# Altium schematic sheet SD_CARD_WiFi.SchDoc: =DocumentName
size B; SheetNumber: 3; SheetTotal: 8
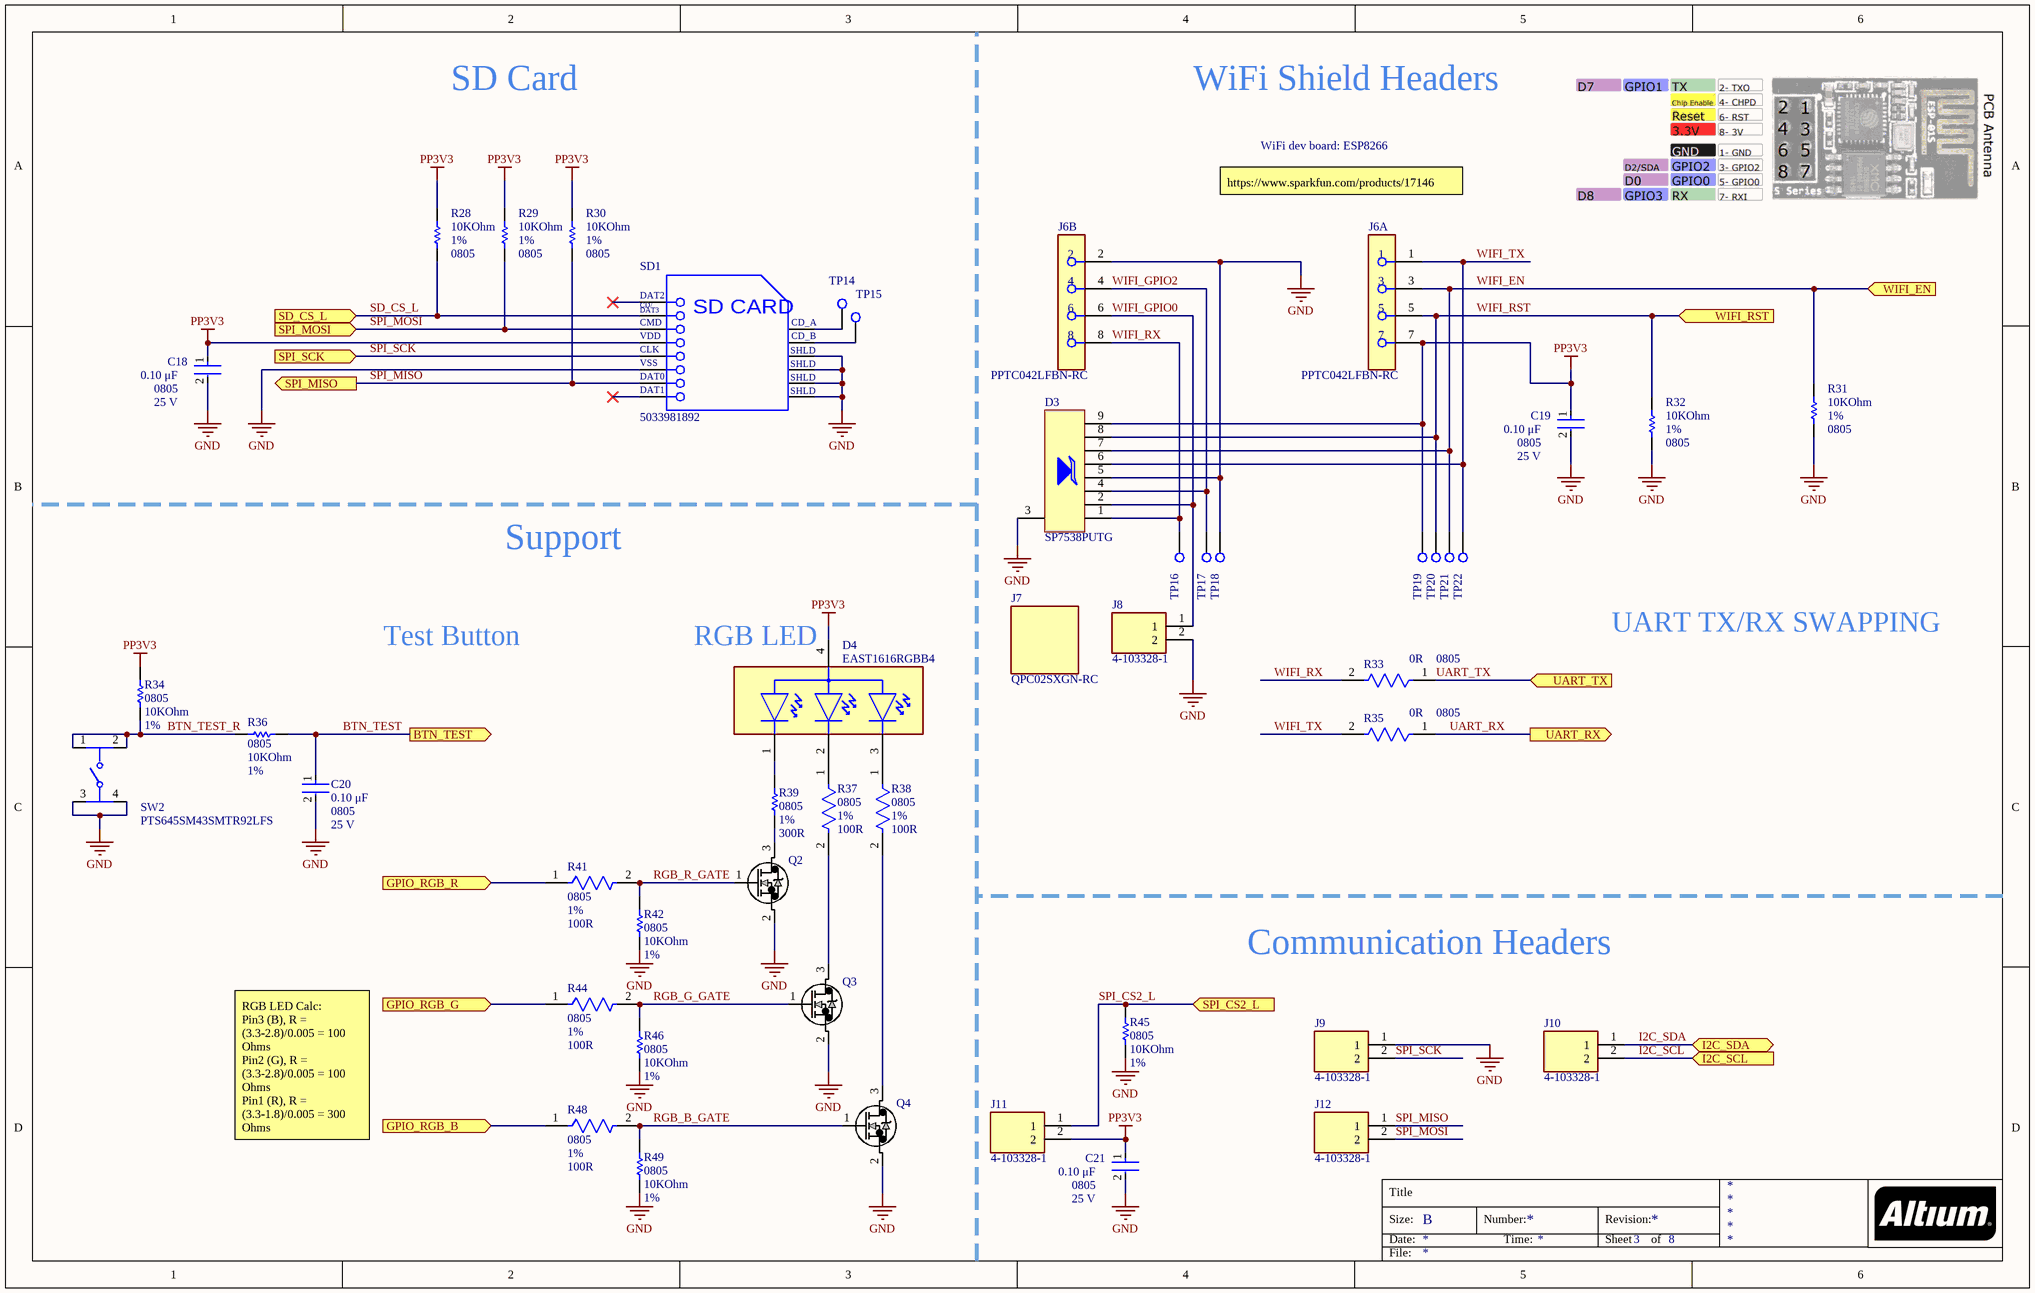
[diagram p0: SD_CARD_WiFi.SchDoc]

## Parts
C18  Capacitance: 0.10 μF  Package: 0805  Voltage Rating: 25 V  [FP-C0805C-DN-IPC_B]  (hidden comment: C0805C104M3RACTU)
C19  Capacitance: 0.10 μF  Package: 0805  Voltage Rating: 25 V  [FP-C0805C-DN-IPC_B]  (hidden comment: C0805C104M3RACTU)
C20  Capacitance: 0.10 μF  Package: 0805  Voltage Rating: 25 V  [FP-C0805C-DN-IPC_B]  (hidden comment: C0805C104M3RACTU)
C21  Capacitance: 0.10 μF  Package: 0805  Voltage Rating: 25 V  [FP-C0805C-DN-IPC_B]  (hidden comment: C0805C104M3RACTU)
D3  SP7538PUTG  [SP7538PUTG]
D4  EAST1616RGBB4  [FP-EAST1616RGBB4-MFG]
J6  PPTC042LFBN-RC  [FP-PPTC042LFBN-RC-MFG]  (parts A,B of 2)
J7  QPC02SXGN-RC  [FP-QPC02SXGN-RC-MFG]
J8  4-103328-1  [TE_4-103328-1]
J9  4-103328-1  [TE_4-103328-1]
J10  4-103328-1  [TE_4-103328-1]
J11  4-103328-1  [TE_4-103328-1]
J12  4-103328-1  [TE_4-103328-1]
Q2  RK7002BMT116  [TRANS_RK7002BMHZG_ROM]  (value not drawn)
Q3  RK7002BMT116  [TRANS_RK7002BMHZG_ROM]  (value not drawn)
Q4  RK7002BMT116  [TRANS_RK7002BMHZG_ROM]  (value not drawn)
R28  value 10KOhm  PackageReference: 0805  Tolerance: 1%  [RESC2013X60X35NL10T20]  (hidden comment: RC0805FR-0710KL)
R29  value 10KOhm  PackageReference: 0805  Tolerance: 1%  [RESC2013X60X35NL10T20]  (hidden comment: RC0805FR-0710KL)
R30  value 10KOhm  PackageReference: 0805  Tolerance: 1%  [RESC2013X60X35NL10T20]  (hidden comment: RC0805FR-0710KL)
R31  value 10KOhm  PackageReference: 0805  Tolerance: 1%  [RESC2013X60X35NL10T20]  (hidden comment: RC0805FR-0710KL)
R32  value 10KOhm  PackageReference: 0805  Tolerance: 1%  [RESC2013X60X35NL10T20]  (hidden comment: RC0805FR-0710KL)
R33  Case/Package: 0805  Resistance: 0R  [FP-RMCF0805-MFG]  (hidden comment: RMCF0805ZT0R00)
R34  value 10KOhm  PackageReference: 0805  Tolerance: 1%  [RESC2013X60X35NL10T20]  (hidden comment: RC0805FR-0710KL)
R35  Case/Package: 0805  Resistance: 0R  [FP-RMCF0805-MFG]  (hidden comment: RMCF0805ZT0R00)
R36  value 10KOhm  Package Reference: 0805  Tolerance: 1%  [RESC2013X50X30ML20T20]  (hidden comment: CRCW080515K0FKTA)
R37  Case Code (Imperial): 0805  Tolerance: 1%  Resistance: 100R  [FP-RMCF0805-IPC_A]  (hidden comment: RMCF0805FT100R)
R38  Case Code (Imperial): 0805  Tolerance: 1%  Resistance: 100R  [FP-RMCF0805-IPC_A]  (hidden comment: RMCF0805FT100R)
R39  PackageReference: 0805  Tolerance: 1%  Resistance: 300R  [RESC2013X70X40ML20T20]  (hidden comment: ERJ-6ENF3000V)
R41  Case Code (Imperial): 0805  Tolerance: 1%  Resistance: 100R  [FP-RMCF0805-IPC_A]  (hidden comment: RMCF0805FT100R)
R42  value 10KOhm  Package Reference: 0805  Tolerance: 1%  [RESC2013X50X30ML20T20]  (hidden comment: CRCW080515K0FKTA)
R44  Case Code (Imperial): 0805  Tolerance: 1%  Resistance: 100R  [FP-RMCF0805-IPC_A]  (hidden comment: RMCF0805FT100R)
R45  value 10KOhm  Package Reference: 0805  Tolerance: 1%  [RESC2013X50X30ML20T20]  (hidden comment: CRCW080515K0FKTA)
R46  value 10KOhm  Package Reference: 0805  Tolerance: 1%  [RESC2013X50X30ML20T20]  (hidden comment: CRCW080515K0FKTA)
R48  Case Code (Imperial): 0805  Tolerance: 1%  Resistance: 100R  [FP-RMCF0805-IPC_A]  (hidden comment: RMCF0805FT100R)
R49  value 10KOhm  Package Reference: 0805  Tolerance: 1%  [RESC2013X50X30ML20T20]  (hidden comment: CRCW080515K0FKTA)
SD1  5033981892  [MOLX-503398-1892_V]
SW2  PTS645SM43SMTR92LFS  [FP-PTS645SM43SMTR92LFS-MFG]
TP14  RCU-0C  [TP+195X110]  (value not drawn)
TP15  RCU-0C  [TP+195X110]  (value not drawn)
TP16  RCU-0C  [TP+195X110]  (value not drawn)
TP17  RCU-0C  [TP+195X110]  (value not drawn)
TP18  RCU-0C  [TP+195X110]  (value not drawn)
TP19  RCU-0C  [TP+195X110]  (value not drawn)
TP20  RCU-0C  [TP+195X110]  (value not drawn)
TP21  RCU-0C  [TP+195X110]  (value not drawn)
TP22  RCU-0C  [TP+195X110]  (value not drawn)

## Ports
BTN_TEST (out), GPIO_RGB_B (in), GPIO_RGB_G (in), GPIO_RGB_R (in), I2C_SCL (in), I2C_SDA (bidir), SD_CS_L (in), SPI_CS2_L (in), SPI_MISO (out), SPI_MOSI (in), SPI_SCK (in), UART_RX (out), UART_TX (in), WIFI_EN (in), WIFI_RST (in)

## Nets
GND: C18.2 C19.2 C20.2 C21.2 D3.3 D3.5 J6.2 J8.2 J9.1 Q2.2 Q3.2 Q4.2 R31.1 R32.1 R42.1 R45.1 R46.1 R49.1 SD1.6(VSS) SD1.11(SHLD) SD1.12(SHLD) SD1.13(SHLD) SD1.14(SHLD) SW2.3 SW2.4 TP18.1
PP3V3: C18.1 C19.1 C21.1 D3.9 D4.4(COMMON_ANODE) J6.7 J11.2 R28.2 R29.2 R30.2 R34.2 SD1.4(VDD) TP19.1
BTN_TEST: C20.1 R36.2 ; port BTN_TEST
BTN_TEST_R: R34.1 R36.1 SW2.1 SW2.2
GPIO_RGB_B: R48.1 ; port GPIO_RGB_B
GPIO_RGB_G: R44.1 ; port GPIO_RGB_G
GPIO_RGB_R: R41.1 ; port GPIO_RGB_R
I2C_SCL: J10.2 ; port I2C_SCL
I2C_SDA: J10.1 ; port I2C_SDA
RGB_B_GATE: Q4.1 R48.2 R49.2
RGB_G_GATE: Q3.1 R44.2 R46.2
RGB_R_GATE: Q2.1 R41.2 R42.2
SD_CS_L: R28.1 SD1.2(CD/DAT3) ; port SD_CS_L
SPI_CS2_L: J11.1 R45.2 ; port SPI_CS2_L
SPI_MISO: J12.1 R30.1 SD1.7(DAT0) ; port SPI_MISO
SPI_MOSI: J12.2 R29.1 SD1.3(CMD) ; port SPI_MOSI
SPI_SCK: J9.2 SD1.5(CLK) ; port SPI_SCK
UART_RX: R35.1 ; port UART_RX
UART_TX: R33.1 ; port UART_TX
WIFI_EN: D3.7 J6.3 R31.2 TP21.1 ; port WIFI_EN
WIFI_GPIO0: D3.2 J6.6 J8.1
WIFI_GPIO2: D3.4 J6.4 TP17.1
WIFI_RST: D3.8 J6.5 R32.2 TP20.1 ; port WIFI_RST
WIFI_RX: D3.1 J6.8 R33.2 TP16.1
WIFI_TX: D3.6 J6.1 R35.2 TP22.1
NetD4_1: D4.1(RED_C) R39.1
NetD4_2: D4.2(GREEN_C) R37.1
NetD4_3: D4.3(BLUE_C) R38.1
NetQ2_3: Q2.3 R39.2
NetQ3_3: Q3.3 R37.2
NetQ4_3: Q4.3 R38.2
NetSD1_9: SD1.9(CD_A) TP14.1
NetSD1_10: SD1.10(CD_B) TP15.1

Not connected (* = marked no-connect by the designer): SD1 1(DAT2)* 8(DAT1)*

## Notes on the sheet
- SD Card
- WiFi Shield Headers
- WiFi dev board: ESP8266
- https://www.sparkfun.com/products/17146
- Support
- UART TX/RX SWAPPING
- Test Button
- RGB LED
- Communication Headers
- RGB LED Calc:
  Pin3 (B), R = (3.3-2.8)/0.005 = 100 Ohms
  Pin2 (G), R = (3.3-2.8)/0.005 = 100 Ohms
  Pin1 (R), R = (3.3-1.8)/0.005 = 300 Ohms
- Title
- Size:
- Date:
- B
- Number:
- Time:
- Revision:
- Sheet
- of
- File:
- (in symbol 5033981892) CD/; DAT3; SD CARD

## Library data of the parts
C18-C21 = CMP-2007-00282-2: CAP CER 0.1UF 25V 20% X7R 0805; Manufacturer: KEMET; Temperature Coefficient: 30ppm/°C; Material: Ceramic; Tolerance: 0.2; Value: 0.10 μF; Digikey Description: CAP CER 0.1UF 25V 20% X7R 0805; Device Class L2: Capacitors; Temperature: -55°C to +125°C; Device Class L1: Passive Components; ComponentLink2Description: Datasheet; Mouser Description: Multilayer Ceramic Capacitors MLCC - SMD/SMT 25volts 0.1uF X7R 20%; Temperature Range High: +125°C; Device Class L3: Ceramic Capacitors; Automotive: No; Temperature Range Low: -55°C; RoHS: TRUE; Category: Cap; Lead Free: Yes; Ipc Land Pattern Name: CAPC200125X78; Height: 0.88mm; Temperature Characteristic: X7R; Octopart: https://octopart.com/c0805c104m3ractu-kemet-9138612; ComponentLink2URL: https://content.kemet.com/datasheets/KEM_C1003_C0G_SMD.pdf; Manufacturer Part Number: C0805C104M3RACTU; Supplier: Digi-Key; Supplier Part Number: 399-C0805C104M3RAC7800CT-ND
D3 = SP7538PUTG: ESD Suppressor TVS Octal Uni-Dir 25kV 9-Pin UDFN T/R; Manufacturer: Littelfuse; Number of Unidirectional Channels: 8; Reverse Standoff Voltage: 5V; Clamping Voltage: 7V; Peak Pulse Current: 2A; Power Line Protection: Yes; Supplier: Digi-Key; RoHS: Yes; Category: TVS Diodes; Stock 1: 40273; Pricing 1: 1=0.95000, 10=0.85200, 100=0.66410, 500=0.54862, 1000=0.43838 (USD); Mount: Surface Mount; Number of Pins: 9; Min Operating Temperature: -40°C; Max Operating Temperature: 150°C; Packaging: Cut Tape; RoHS Compliant: Yes; ComponentLink1URL: http://www.littelfuse.com/~/media/electronics/datasheets/tvs_diode_arrays/littelfuse_tvs_diode_array_sp7538p_datasheet.pdf.pdf?src-supplier=Farnell; ComponentLink1Description: http://www.littelfuse.com/~/media/electronics/datasheets/tvs_diode_arrays/littelfuse_tvs_diode_array_sp7538p_datasheet.pdf.pdf?src-supplier=Farnell; ComponentLink2URL: http://www.littelfuse.com/~/media/electronics/datasheets/tvs_diode_arrays/littelfuse_tvs_diode_array_sp7538p_datasheet.pdf.pdf?src-supplier=Digi-Key; ComponentLink2Description: http://www.littelfuse.com/~/media/electronics/datasheets/tvs_diode_arrays/littelfuse_tvs_diode_array_sp7538p_datasheet.pdf.pdf?src-supplier=Digi-Key; ComponentLink3URL: https://www.littelfuse.com/~/media/electronics/datasheets/tvs_diode_arrays/littelfuse_tvs_diode_array_sp7538p_datasheet.pdf.pdf?src-supplier=Digi-Key; ComponentLink3Description: https://www.littelfuse.com/~/media/electronics/datasheets/tvs_diode_arrays/littelfuse_tvs_diode_array_sp7538p_datasheet.pdf.pdf?src-supplier=Digi-Key; ComponentLink4URL: http://www.littelfuse.com/~/media/electronics/datasheets/tvs_diode_arrays/littelfuse_tvs_diode_array_sp7538p_datasheet.pdf.pdf?src-supplier=Arrow+Electronics; ComponentLink4Description: http://www.littelfuse.com/~/media/electronics/datasheets/tvs_diode_arrays/littelfuse_tvs_diode_array_sp7538p_datasheet.pdf.pdf?src-supplier=Arrow+Electronics; ComponentLink5URL: http://www.littelfuse.com/~/media/electronics/datasheets/tvs_diode_arrays/littelfuse_tvs_diode_array_sp7538p_datasheet.pdf.pdf?src-supplier=Mouser; ComponentLink5Description: http://www.littelfuse.com/~/media/electronics/datasheets/tvs_diode_arrays/littelfuse_tvs_diode_array_sp7538p_datasheet.pdf.pdf?src-supplier=Mouser; ComponentLink6URL: http://www.littelfuse.com/~/media/electronics/datasheets/tvs_diode_arrays/littelfuse_tvs_diode_array_sp7538p_datasheet.pdf.pdf?src-supplier=Verical; ComponentLink6Description: http://www.littelfuse.com/~/media/electronics/datasheets/tvs_diode_arrays/littelfuse_tvs_diode_array_sp7538p_datasheet.pdf.pdf?src-supplier=Verical; ComponentLink7URL: http://www.littelfuse.com/~/media/electronics/datasheets/tvs_diode_arrays/littelfuse_tvs_diode_array_sp7538p_datasheet.pdf.pdf?src-supplier=Newark; ComponentLink7Description: http://www.littelfuse.com/~/media/electronics/datasheets/tvs_diode_arrays/littelfuse_tvs_diode_array_sp7538p_datasheet.pdf.pdf?src-supplier=Newark; ComponentLink8URL: http://www.littelfuse.com/~/media/electronics/datasheets/tvs_diode_arrays/littelfuse_tvs_diode_array_sp7538p_datasheet.pdf.pdf?src-supplier=TTI; ComponentLink8Description: http://www.littelfuse.com/~/media/electronics/datasheets/tvs_diode_arrays/littelfuse_tvs_diode_array_sp7538p_datasheet.pdf.pdf?src-supplier=TTI; Supplier Part Number: F7417CT-ND; Manufacturer Part Number: SP7538PUTG
D4 = EAST1616RGBB4: LED RGB CLEAR 4SMD; Manufacturer: Everlight Electronics Co Ltd; Element Configuration: Common Anode; Test Current: 5mA; Lens Color: Colorless; Lens Size: 1.1mm; Viewing Angle: 120°; Color: Blue; Lens Style: Flat; Forward Voltage: 2.8V; Mount: Surface Mount; Length: 1.6mm; Packaging: Tape and Reel; Case/Package: 0606; Lens Transparency: Clear; Case Code (Metric): 1616; Width: 1.6mm; Height: 0.45mm; Case Code (Imperial): 0606; Manufacturer Part Number: EAST1616RGBB4; Supplier: Digi-Key; Supplier Part Number: 1080-1552-1-ND
J6 = PPTC042LFBN-RC: CONN HDR 8POS 0.1 TIN PCB; Manufacturer: Sullins Connector Solutions; Is Female: yes; Conn Orientation: Straight; Conn Gender: Female; Number Of Contacts: 8; Pitch: 2.54mm; Voltage Rating: 250V; Current Rating: 3A; Package: PPTC042LFBN-RC; Number Of Rows: 2; Manufacturer Part Number: PPTC042LFBN-RC; Contact Material: Tin,Nickel; Temperature: -40°C to +105°C; Height: 8.65mm; Device Class L2: Headers and Wire Housings; Octopart: https://octopart.com/pptc042lfbn-rc-sullins-271088; RoHS: TRUE; ComponentLink2URL: https://drawings-pdf.s3.amazonaws.com/10492.pdf; Lead Free: Yes; Automotive: No; Device Class L3: unset; ComponentLink2Description: Datasheet; Temperature Range High: +105°C; Digikey Description: CONN HDR 8POS 0.1 TIN PCB; Category: Conn; Device Class L1: Connectors; Temperature Range Low: -40°C; Supplier: Digi-Key; Supplier Part Number: S7072-ND
J7 = CMP-25666-000001-1: CONN JUMPER SHORTING .100" GOLD; Manufacturer: Sullins; Conn Orientation: Straight; Pitch: 2.54mm; Current Rating: 3A; Number Of Contacts: 2; Category: Conn; Temperature Range Low: -40°C; Temperature Range High: +85°C; Device Class L1: Connectors; Lead Free: Yes; Manufacturer Part Number: QPC02SXGN-RC; Automotive: No; Height: 6.17mm; ComponentLink2URL: https://s3.amazonaws.com/catalogspreads-pdf/PAGE128-129%20.100%20JUMPER.pdf; Device Class L2: unset; Footprint Url: https://drawings-pdf.s3.amazonaws.com/11510.pdf; Device Class L3: unset; Temperature: -40°C to +85°C; RoHS: TRUE; Digikey Description: CONN JUMPER SHORTING .100" GOLD; Octopart: https://octopart.com/qpc02sxgn-rc-sullins-19878795; Package: 0; ComponentLink2Description: Datasheet; Contact Material: Gold; Supplier: Digi-Key; Supplier Part Number: S9337-ND
J8-J12 = 4-103328-1: Connector Header Through Hole 2 position; Manufacturer: TE Connectivity AMP Connectors; MF: TE Connectivity; SnapEDA_Link: https://www.snapeda.com/parts/4-103328-1/TE%20Connectivity%20AMP%20Connectors/view-part/2384420/?ref=snap; MP: 4-103328-1; TE_purchase_URL: https://www.te.com/usa-en/product-4-103328-1.html?te_bu=Cor&te_type=disp&te_campaign=seda_glo_cor-seda-global-disp-prtnr-fy19-seda-model-bom-cta_sma-317_1&elqCampaignId=32493; Availability: Unavailable; Value: *; EU_RoHS_Compliance: Compliant; Price: None; Package: None; Supplier: Digi-Key; Supplier Part Number: A121364-ND; Manufacturer Part Number: 4-103328-1
Q2-Q4 = RK7002BMT116: No Description Available; Mfr_Name: ROHM Semiconductor; Type: DEV; Copyright: Copyright (C) 2022 Ultra Librarian. All rights reserved.; Digi-Key_Part_Number_1: RK7002BMT116CT-ND; Digi-Key_Part_Number_2: RK7002BMT116DKR-ND; Digi-Key_Part_Number_3: RK7002BMT116TR-ND; RefDes: RefDes; Manufacturer_Part_Number: RK7002BMT116; Manufacturer: Rohm Semiconductor; Manufacturer Part Number: RK7002BMT116; Supplier: Digi-Key; Supplier Part Number: RK7002BMT116CT-ND
R28-R32 R34 = CMP-1659-00013-4: Chip Resistor, 10 KOhm, +/- 1%, 0.125 W, -55 to 155 degC, 0805 (2012 Metric), RoHS, Tape and Reel; Manufacturer: Yageo; Voltage Rating: 150 V; Mount: Surface Mount; ComponentLink1Description: Manufacturer URL; ComponentLink2URL: http://www.yageo.com/documents/recent/PYu-RC_Group_51_RoHS_L_04.pdf; Pins: 2; Length: 2 mm; Min Operating Temperature: -55 degC; Height: 0.5 mm; Mounting Technology: Surface Mount; RoHSCompliant: true; REACH SVHC: No SVHC; ComponentLink1URL: http://www.yageo.com/; Max Operating Temperature: 155 degC; DatasheetVersion: Rev. 4, 02/2016; Package Quantity: 5000; Packaging: Tape and Reel; ComponentLink2Description: Datasheet; PackageDescription: 2-Pin Surface Mounted Device, Body 2 x 1.25 mm; Manufacturer Part Number: RC0805FR-0710KL; Supplier: Digi-Key; Supplier Part Number: RC0805FR-0710KL
R33 R35 = CMP-26527-000017-1: RES 0 OHM JUMPER 1/8W 0805; Manufacturer: Stackpole Electronics Inc; Power Rating: 125mW; Depth: 1.25mm; Length: 2mm; Military Standard: Not; Width: 0.049inch; Case Code (Imperial): 0805; Number of Terminations: 2; Mount: Surface Mount; Contact Plating: Tin; Height: 0.026inch; Min Operating Temperature: -55°C; Composition: Thick Film; Max Operating Temperature: 155°C; Packaging: Tape and Reel; Features: Automotive AEC-Q200; Max Power Dissipation: 125mW; Radiation Hardening: No; Lead Free: Lead Free; Case Code (Metric): 2012; Supplier: Digi-Key; Supplier Part Number: RMCF0805ZT0R00CT-ND; Manufacturer Part Number: RMCF0805ZT0R00
R36 R42 R45 R46 R49 = CMP-2001-04968-1: Manufacturer: Vishay Dale; Manufacturer Part Number: CRCW080515K0FKTA; Supplier: Digi-Key; Supplier Part Number: 541-3019-1-ND
R37 R38 R41 R44 R48 = CMP-26527-001731-1: 100Ω ±1% 0.125W 0805 Thick Film Chip Resistor AEC-Q200 compliant; Manufacturer: Stackpole Electronics Inc; Power Rating: 250mW; Temperature Coefficient: 100ppm/°C; Max Power Dissipation: 125mW; Radiation Hardening: No; RoHS Compliant: Yes; Depth: 1.25mm; Length: 2mm; Min Operating Temperature: -55°C; Series: RMCF; Packaging: Tape and Reel; Features: Automotive AEC-Q200; Height: 0.026inch; Size Code: 0805; Number of Terminations: 2; Max Operating Temperature: 155°C; Case/Package: 0805; Width: 0.049inch; Contact Plating: Tin; Resistor Type: Thick Film; Construction: Rectangular; Lead Free: Lead Free; Military Standard: Not; Case Code (Metric): 2012; Mount: Surface Mount; Manufacturer Part Number: RMCF0805FT100R; Supplier: Digi-Key; Supplier Part Number: RMCF0805FT100RCT-ND
R39 = CMP-2001-00110-5: Chip Resistor, 300 Ohm, +/- 1%, 0.125 W, -55 to 155 degC, 0805 (2012 Metric), RoHS, Tape and Reel; Manufacturer: Panasonic; Voltage Rating: 150 V; Package Quantity: 5000; PackageDescription: 2-Pin Surface Mount Device, Body 2 x 1.25 mm; Mounting Technology: Surface Mount; ComponentLink2URL: http://industrial.panasonic.com/cdbs/www-data/pdf/RDA0000/AOA0000C86.pdf; DatasheetVersion: 04/2015; ComponentLink1URL: http://www.panasonic.com/; Mount: Surface Mount; ComponentLink1Description: Manufacturer URL; RoHSCompliant: true; Min Operating Temperature: -55 degC; Height: 0.6 mm; ComponentLink2Description: Datasheet; Max Operating Temperature: 155 degC; Length: 2 mm; Packaging: Tape and Reel; REACH SVHC: Yes; Manufacturer Part Number: ERJ-6ENF3000V; Supplier: Digi-Key; Supplier Part Number: P300CCT-ND
SD1 = 5033981892: Micro SD Connector, Pitch 1.1 mm, 8 Position, Height 1.4 mm, -25 to 85 degC, RoHS, Tape and Reel; Manufacturer: Molex; Voltage Rating: 10VAC/DC; Current Rating: 500mA; Manufacturer URL: http://www.molex.com/; Package Reference: 503398-1892; Packaging: Reel; RoHS: Details; Brand: Molex; Datasheet URL: http://www.molex.com/pdm_docs/sd/5033981892_sd.pdf; Mounting Technology: SurfaceMount; Factory Pack Quantity: 2400; Datasheet Version: Rev. E, 04/2006; Series: 503398; Product Category: MemoryCardConnectors; Package Description: Micro SD Connector, Pitch 1.1 mm, 8 Position, Height 1.4 mm; Supplier: Digi-Key; Supplier Part Number: WM11190CT-ND; Manufacturer Part Number: 5033981892
SW2 = PTS645SM43SMTR92_LFS: SWITCH TACTILE SPST-NO 0.05A 12V; Manufacturer: C&K; Contact Resistance: 100mR; Throw Configuration: SPST; Illumination Type: Non-Illuminated; Mechanical Life: 100000Cycles; Current Rating: 50mA; Switch Function: Off-Mom; Actuator Length: 0.85mm; Actuator Material: Nylon; Actuator Type: Standard; Operating Force: 160gf; Min Operating Temperature: -20°C; REACH SVHC: No SVHC; Termination: Gull Wing; Case/Package: SMD/SMT; Packaging: Tape and Reel; Mount: Surface Mount; Voltage Rating (DC): 12V; Orientation: Straight; Lead Free: Lead Free; Contact Material: Silver; Color: Black; Max Current Rating: 50mA; Contact Plating: Silver; Depth: 9mm; Package Quantity: 1; Max Voltage Rating (DC): 12V; Length: 6mm; Max Operating Temperature: 60°C; Manufacturer Part Number: PTS645SM43SMTR92 LFS; Supplier: Digi-Key; Supplier Part Number: CKN9112CT-ND
TP14-TP22 = RCU-0C: Natural PC Test Point , Plating Surface Mount Mounting Type; Manufacturer: TE Connectivity AMP Connectors; Value: *; Package: SON-6 TE Connectivity AMP Connectors; Purchase-URL: https://pricing.snapeda.com/search/part/RCU-0C/?ref=eda; Supplier Part Number: A106145CT-ND; Check_prices: https://www.snapeda.com/parts/RCU-0C/TE%20Connectivity/view-part/4791537/?ref=eda; Manufacturer Part Number: RCU-0C; SnapEDA_Link: https://www.snapeda.com/parts/RCU-0C/TE%20Connectivity/view-part/4791537/?ref=snap; Supplier: Digi-Key